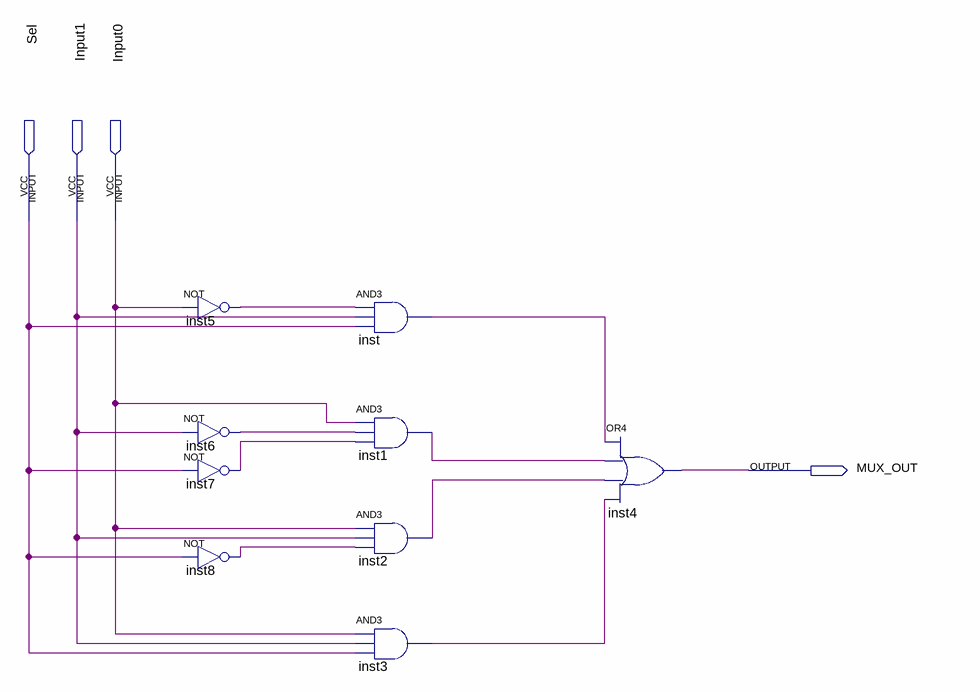
[diagram p0: schematic sheet]
// Quartus schematic 21MUX_GATES.bdf as structural Verilog: 9 symbols, 4 pins
module \21MUX_GATES  (
  input  Sel,
  input  Input1,
  input  Input0,
  output MUX_OUT
);

  wire inst1_out, inst2_out, inst3_out, inst5_out, inst6_out, inst7_out, inst8_out, inst_out;

  not inst5 (inst5_out, Input0);
  not inst6 (inst6_out, Input1);
  not inst7 (inst7_out, Sel);
  not inst8 (inst8_out, Sel);
  and inst (inst_out, inst5_out, Input1, Sel);
  and inst1 (inst1_out, Input0, inst6_out, inst7_out);
  and inst2 (inst2_out, Input0, Input1, inst8_out);
  and inst3 (inst3_out, Input0, Input1, Sel);
  or inst4 (MUX_OUT, inst_out, inst1_out, inst2_out, inst3_out);
endmodule
